# EAGLE schematic esquema-eletrico-17103449 (EAGLE 9.6.2)
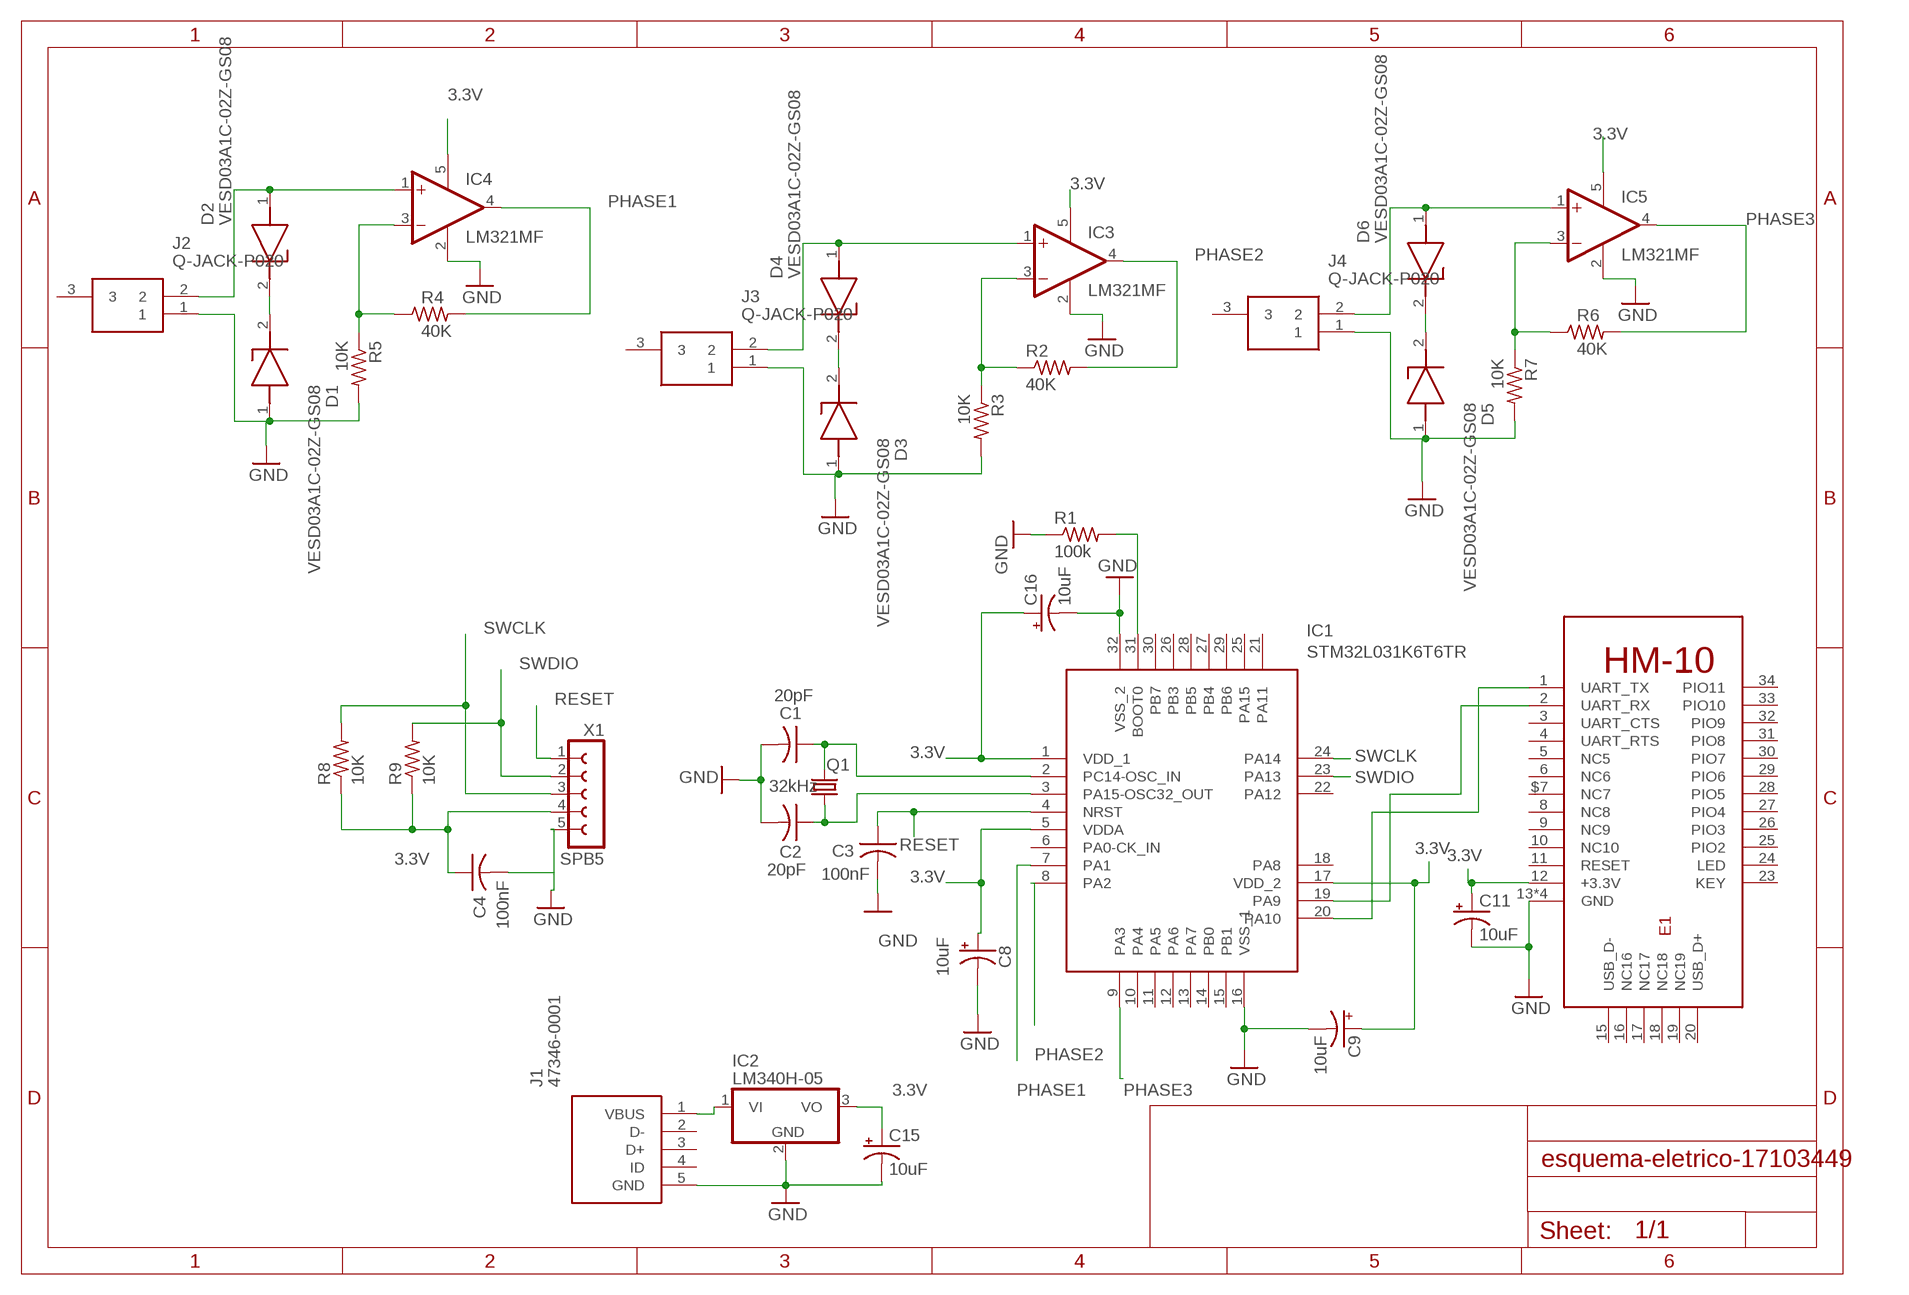
[diagram p0: schematic, sheet 1]

## Parts
C1  20pF  C-USC0805  [C0805]
C2  20pF  C-USC0805  [C0805]
C3  100nF  C-USC0805  [C0805]
C4  100nF  C-USC0805  [C0805]
C8  10uF  CPOL-USE2-5  [E2-5]
C9  10uF  CPOL-USE2-5  [E2-5]
C11  10uF  CPOL-USE2-5  [E2-5]
C15  10uF  CPOL-USE2-5  [E2-5]
C16  10uF  CPOL-USE2-5  [E2-5]
D1  VESD03A1C-02Z-GS08  [VESD03A1C02ZGS08]
D2  VESD03A1C-02Z-GS08  [VESD03A1C02ZGS08]
D3  VESD03A1C-02Z-GS08  [VESD03A1C02ZGS08]
D4  VESD03A1C-02Z-GS08  [VESD03A1C02ZGS08]
D5  VESD03A1C-02Z-GS08  [VESD03A1C02ZGS08]
D6  VESD03A1C-02Z-GS08  [VESD03A1C02ZGS08]
E1  HM-10-BOARD  [26.9X13X2.2_BOARD]
IC1  STM32L031K6T6TR  [QFP80P900X900X160-32N]
IC2  LM340H-05  [TO220H]
IC3  LM321MF  [SOT23-5]
IC4  LM321MF  [SOT23-5]
IC5  LM321MF  [SOT23-5]
J1  47346-0001  [47346-0001]
J2  Q-JACK-P020  [QJACKP020]
J3  Q-JACK-P020  [QJACKP020]
J4  Q-JACK-P020  [QJACKP020]
Q1  32kHz  CRYSTALHC49S  [HC49/S]
R1  100k  R-US_0204/7  [0204/7]
R2  40K  R-US_WSC2515  [WSC2515]
R3  10K  R-US_WSC2515  [WSC2515]
R4  40K  R-US_WSC2515  [WSC2515]
R5  10K  R-US_WSC2515  [WSC2515]
R6  40K  R-US_WSC2515  [WSC2515]
R7  10K  R-US_WSC2515  [WSC2515]
R8  10K  R-US_WSC2515  [WSC2515]
R9  10K  R-US_WSC2515  [WSC2515]
X1  SPB5  [SPB5]

## Nets
3.3V: C4.1 C8.+ C9.+ C11.+ C15.+ C16.+ E1.12(+3.3V) IC1.1(VDD_1) IC1.5(VDDA) IC1.17(VDD_2) IC2.3(VO) IC3.5(V+) IC4.5(V+) R8.1 R9.1 X1.4
GND: C1.2 C2.2 C3.2 C4.2 C8.- C9.- C11.- C15.- C16.- D1.1(A) D3.1(A) D5.1(A) E1.13(GND) E1.14(GND) E1.21(GND) E1.22(GND) IC1.16(VSS_1) IC1.32(VSS_2) IC2.2(GND) IC3.2(V-) IC4.2(V-) IC5.2(V-) J1.5(GND) J2.1 J3.1 J4.1 R1.1 R3.2 R5.2 R7.2 X1.5
N$1: C1.1 IC1.2(PC14-OSC_IN) Q1.2
N$2: C2.1 IC1.3(PA15-OSC32_OUT) Q1.1
N$3: IC2.1(VI) J1.1(VBUS)
N$5: IC3.3(-IN) R2.1 R3.1
N$7: IC5.3(-IN) R6.1 R7.1
N$8: E1.2(UART_RX) IC1.19(PA9)
N$9: IC1.31(BOOT0) R1.2
N$10: IC5.5(V+)
N$11: IC4.3(-IN) R4.1 R5.1
N$12: D3.2(K) D4.2(K)
N$14: E1.1(UART_TX) IC1.20(PA10)
N$15: D1.2(K) D2.2(K)
N$16: D2.1(A) IC4.1(+IN) J2.2
N$17: D4.1(A) IC3.1(+IN) J3.2
N$18: D5.2(K) D6.2(K)
N$19: D6.1(A) IC5.1(+IN) J4.2
PHASE1: IC1.7(PA1) IC4.4(OUT) R4.2
PHASE2: IC1.8(PA2) IC3.4(OUT) R2.2
PHASE3: IC1.9(PA3) IC5.4(OUT) R6.2
RESET: C3.1 IC1.4(NRST) X1.1
SWCLK: IC1.24(PA14) R8.2 X1.3
SWDIO: IC1.23(PA13) R9.2 X1.2
Unconnected: E1.3(UART_CTS) E1.4(UART_RTS) E1.5(NC5) E1.6(NC6) E1.8(NC8) E1.9(NC9) E1.10(NC10) E1.11(RESET) E1.15(USB_D-) E1.16(NC16) E1.17(NC17) E1.18(NC18) E1.19(NC19) E1.20(USB_D+) E1.23(KEY) E1.24(LED) E1.25(PIO2) E1.26(PIO3) E1.27(PIO4) E1.28(PIO5) E1.29(PIO6) E1.30(PIO7) E1.31(PIO8) E1.32(PIO9) E1.33(PIO10) E1.34(PIO11) E1.$7(NC7) IC1.6(PA0-CK_IN) IC1.10(PA4) IC1.11(PA5) IC1.12(PA6) IC1.13(PA7) IC1.14(PB0) IC1.15(PB1) IC1.18(PA8) IC1.21(PA11) IC1.22(PA12) IC1.25(PA15) IC1.26(PB3) IC1.27(PB4) IC1.28(PB5) IC1.29(PB6) IC1.30(PB7) J1.2(D-) J1.3(D+) J1.4(ID) J2.3 J3.3 J4.3

## Library data of the parts
C1-C4 = rcl:C-US: CAPACITOR, American symbol; SPICEPREFIX: C
C8 C9 C11 C15 C16 = rcl:CPOL-US: POLARIZED CAPACITOR, American symbol; SPICEPREFIX: C
D1-D6 = VESD03A1C-02Z-GS08:VESD03A1C-02Z-GS08: ESD Protection Diode In SOD923 Source: Datasheet <http://www.icpdf.com/VISHAY_datasheet/VESD03A1C-02Z_pdf_9299348/#view>; DESCRIPTION: ESD Protection Diode In SOD923; HEIGHT: 0.41mm; MANUFACTURER_NAME: Vishay; MANUFACTURER_PART_NUMBER: VESD03A1C-02Z-GS08; MOUSER_PART_NUMBER: 78-VESD03A1C-02Z; MOUSER_PRICE-STOCK: https://www.mouser.co.uk/ProductDetail/Vishay-Semiconductors/VESD03A1C-02Z-GS08?qs=wo%252BHxaeevUhRha6H5SMt4g%3D%3D
E1 = hm10:HM-10: HM Bluetooth module use TI CC2540 or CC2541, Master and slave roles in one, transmission version and remote control version and PIO state acquisition functions in one, Support the AT command modify module parameters, Convenient and flexible.
IC1 = STM32L031K6T6TR:STM32L031K6T6TR: STMICROELECTRONICS - STM32L031K6T6TR - ARM MCU, STM32 Family STM32L0 Series Microcontrollers, ARM Cortex-M0+, 32bit, 32 MHz, 32 KB, 8 KB Source: Datasheet <https://4donline.ihs.com/images/VipMasterIC/IC/SGST/SGST-S-A0002219924/SGST-S-A0002219924-1.pdf?hkey=6D3A4C79FDBF58556ACFDE234799DDF0>; ARROW_PART_NUMBER: STM32L031K6T6TR; ARROW_PRICE-STOCK: https://www.arrow.com/en/products/stm32l031k6t6tr/stmicroelectronics; DESCRIPTION: STMICROELECTRONICS - STM32L031K6T6TR - ARM MCU, STM32 Family STM32L0 Series Microcontrollers, ARM Cortex-M0+, 32bit, 32 MHz, 32 KB, 8 KB; HEIGHT: 1.6mm; MANUFACTURER_NAME: STMicroelectronics; MANUFACTURER_PART_NUMBER: STM32L031K6T6TR; MOUSER_PART_NUMBER: 511-STM32L031K6T6TR; MOUSER_PRICE-STOCK: https://www.mouser.co.uk/ProductDetail/STMicroelectronics/STM32L031K6T6TR/?qs=xwQlLnDx56Cmxri8cgW0QQ%3D%3D
IC2 = linear:LM340?-*: Positive VOLTAGE REGULATOR Source: http://cache.national.com/ds/LM/LM340.pdf
IC3-IC5 = linear:LM321?*: Low Power Single Op Amp Source: http://cache.national.com/ds/LM/LM321.pdf
J1 = 47346-0001:47346-0001: Micro USB B Receptacle Bottom Mount Assy Molex Right Angle SMT Type B Version 2.0 Micro USB Connector Socket, 30 V ac, 1A 47352 MICRO-USB Source: Datasheet <http://www.molex.com/pdm_docs/sd/473460001_sd.pdf>; DESCRIPTION: Micro USB B Receptacle Bottom Mount Assy Molex Right Angle SMT Type B Version 2.0 Micro USB Connector Socket, 30 V ac, 1A 47352 MICRO-USB; HEIGHT: mm; MANUFACTURER_NAME: Molex; MANUFACTURER_PART_NUMBER: 47346-0001; MOUSER_PART_NUMBER: 538-47346-0001; MOUSER_PRICE-STOCK: https://www.mouser.co.uk/ProductDetail/Molex/47346-0001?qs=c2CV6XM0DweJBWaSeyWeCw%3D%3D
J2-J4 = Q-JACK-P020:Q-JACK-P020: Measurement, 2.5/2.0. Circuits, -. Current Rating, 0.5A AC DC. Voltage Rating, 50V AC DC. Temperature rating: -25~+85. Contact resistance, 30m max. Source: Datasheet <https://4donline.ihs.com/images/VipMasterEMD/EMD/LEOC/LEOCD00002/LEOCD00002-G28.pdf?hkey=EF798316E3902B6ED9A73243A3159BB0>; DESCRIPTION: Measurement, 2.5/2.0. Circuits, -. Current Rating, 0.5A AC DC. Voltage Rating, 50V AC DC. Temperature rating: -25~+85. Contact resistance, 30m max.; HEIGHT: 7.3mm; MANUFACTURER_NAME: Leoco; MANUFACTURER_PART_NUMBER: Q-JACK-P020
Q1 = crystal:CRYSTAL: CRYSTAL; OC_FARNELL: 1667008; OC_NEWARK: unknown
R1-R9 = rcl:R-US_: RESISTOR, American symbol; SPICEPREFIX: R
X1 = con-hirschmann:SPB5: CONNECTOR 5 pins; OC_FARNELL: unknown; OC_NEWARK: unknown